# EAGLE schematic NanoAnalogic (EAGLE 5.11)
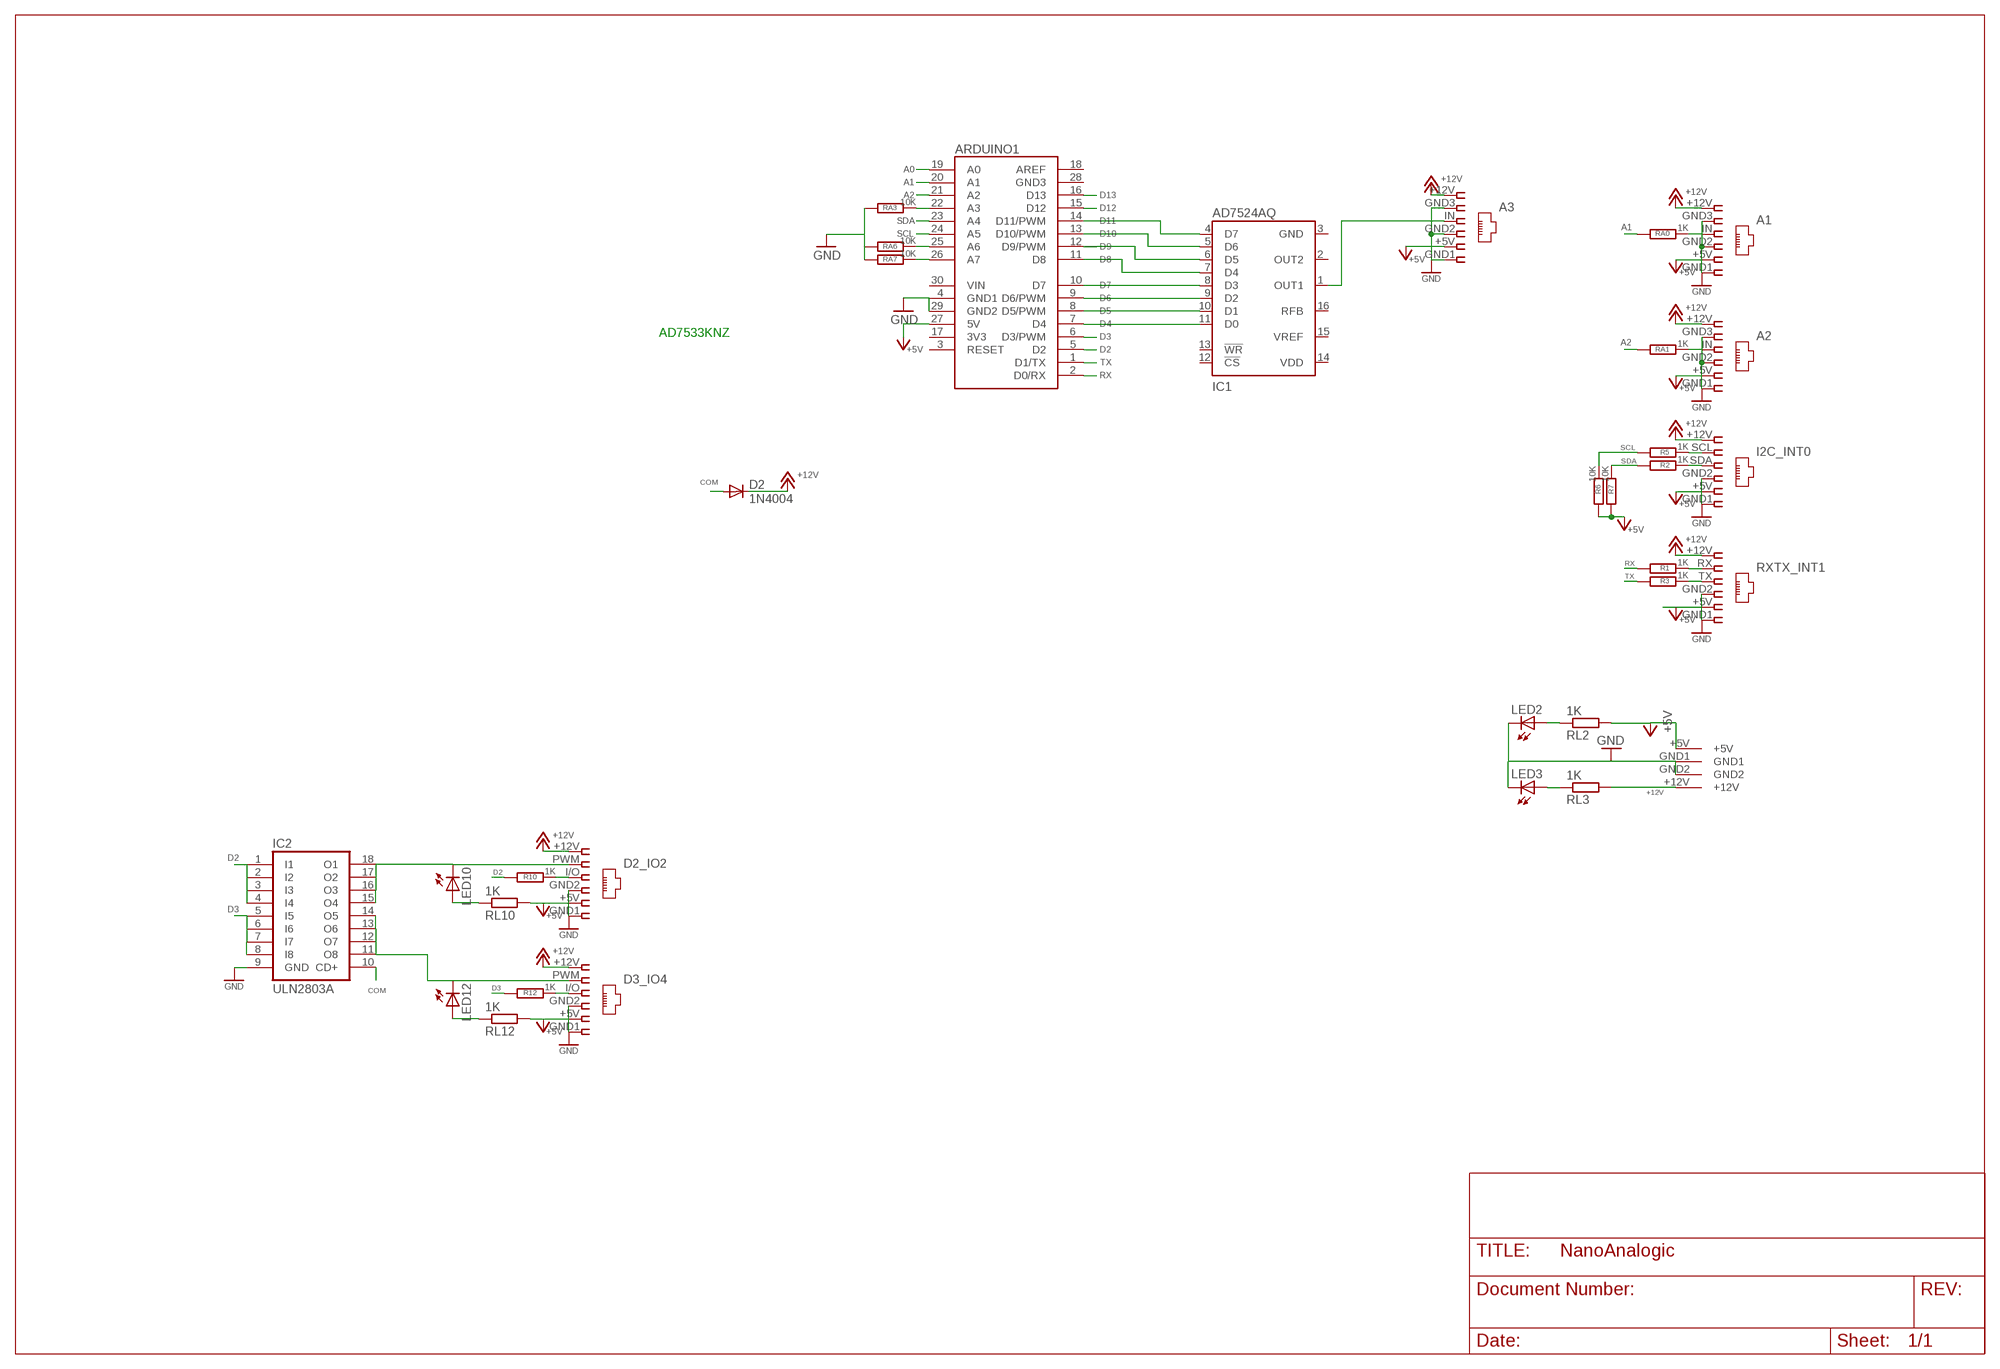
[diagram p0: schematic, sheet 1]

## Parts
A1  ANALOG1  RJ12STRAIGHT-ANALOG  [RJ12-STRAIGHT-ANALOG]
A2  ANALOG2  RJ12STRAIGHT-ANALOG  [RJ12-STRAIGHT-ANALOG]
A3  ANALOG1  RJ12STRAIGHT-ANALOG  [RJ12-STRAIGHT-ANALOG]
ARDUINO1  ARDUINO_NANO  [ARDUINO_NANO]
D2  1N4004  [DO41-10]
D2_IO2  IO2  RJ12STRAIGHT  [RJ12-STRAIGHT]
D3_IO4  IO4  RJ12STRAIGHT  [RJ12-STRAIGHT]
I2C_INT0  I2C  RJ12STRAIGHT-I2C  [RJ12-STRAIGHT-I2C]
IC1  AD7524AQ  [DIL16]
IC2  ULN2803A  [SO18W]
LED2  LED3MM  [LED3MM]
LED3  LED3MM  [LED3MM]
LED10  LED3MM  [LED3MM]
LED12  LED3MM  [LED3MM]
R1  1K  R-EU_M1206  [M1206]
R2  1K  R-EU_M1206  [M1206]
R3  1K  R-EU_M1206  [M1206]
R5  1K  R-EU_M1206  [M1206]
R6  10K  R-EU_M1206  [M1206]
R7  10K  R-EU_M1206  [M1206]
R10  1K  R-EU_M1206  [M1206]
R12  1K  R-EU_M1206  [M1206]
RA0  1K  R-EU_M1206  [M1206]
RA1  1K  R-EU_M1206  [M1206]
RA3  10K  R-EU_M1206  [M1206]
RA6  10K  R-EU_M1206  [M1206]
RA7  10K  R-EU_M1206  [M1206]
RL2  1K  R-EU_M1206  [M1206]
RL3  1K  R-EU_M1206  [M1206]
RL10  1K  R-EU_M1206  [M1206]
RL12  1K  R-EU_M1206  [M1206]
RXTX_INT1  RS232  RJ12STRAIGHT-RS232-SERVER  [RJ12-STRAIGHT-RS232]
U$1  KPJX-4S-S  [KPJX-4S-S]

## Nets
+5V [highpower]: A1.+5V A2.+5V A3.+5V ARDUINO1.27(5V) D2_IO2.+5V D3_IO4.+5V I2C_INT0.+5V R6.2 R7.2 RL2.2 RL10.2 RL12.2 RXTX_INT1.+5V U$1.+5V
+12V [highpower]: A1.+12V A2.+12V A3.+12V D2.C D2_IO2.+12V D3_IO4.+12V I2C_INT0.+12V RL3.2 RXTX_INT1.+12V U$1.+12V
A0: ARDUINO1.19(A0)
A1: ARDUINO1.20(A1) RA0.2
A2: ARDUINO1.21(A2) RA1.2
COM: D2.A IC2.10(CD+)
D2: ARDUINO1.5(D2) IC2.1(I1) IC2.2(I2) IC2.3(I3) IC2.4(I4) R10.2
D2B2: D2_IO2.I/O R10.1
D2B3: D3_IO4.I/O R12.1
D2B4: I2C_INT0.SDA R2.1
D2B5: R3.1 RXTX_INT1.TX
D2B8: A1.IN RA0.1
D2B9: A2.IN RA1.1
D3: ARDUINO1.6(D3/PWM) IC2.5(I5) IC2.6(I6) IC2.7(I7) IC2.8(I8) R12.2
D4: ARDUINO1.7(D4) IC1.11(D0)
D5: ARDUINO1.8(D5/PWM) IC1.10(D1)
D6: ARDUINO1.9(D6/PWM) IC1.9(D2)
D7: ARDUINO1.10(D7) IC1.8(D3)
D8: ARDUINO1.11(D8) IC1.7(D4)
D9: ARDUINO1.12(D9/PWM) IC1.6(D5)
D10: ARDUINO1.13(D10/PWM) IC1.5(D6)
D11: ARDUINO1.14(D11/PWM) IC1.4(D7)
D12: ARDUINO1.15(D12)
D13: ARDUINO1.16(D13)
GND [highpower]: A1.GND1 A1.GND2 A1.GND3 A2.GND1 A2.GND2 A2.GND3 A3.GND1 A3.GND2 A3.GND3 ARDUINO1.4(GND1) ARDUINO1.29(GND2) D2_IO2.GND1 D2_IO2.GND2 D3_IO4.GND1 D3_IO4.GND2 I2C_INT0.GND1 I2C_INT0.GND2 IC2.9(GND) LED2.K(C) LED3.K(C) RA3.2 RA6.2 RA7.2 RXTX_INT1.GND1 RXTX_INT1.GND2 U$1.GND1 U$1.GND2
N$1 [power]: D3_IO4.PWM IC2.11(O8) IC2.12(O7) IC2.13(O6) IC2.14(O5) LED12.K(C)
N$5: A3.IN IC1.1(OUT1)
N$7: R1.1 RXTX_INT1.RX
N$8: I2C_INT0.SCL R5.1
N$13: LED3.A RL3.1
N$16: ARDUINO1.22(A3) RA3.1
N$20: ARDUINO1.25(A6) RA6.1
N$21: LED10.A RL10.1
N$22: ARDUINO1.26(A7) RA7.1
N$23: LED2.A RL2.1
N$24 [power]: D2_IO2.PWM IC2.15(O4) IC2.16(O3) IC2.17(O2) IC2.18(O1) LED10.K(C)
N$28: LED12.A RL12.1
RX: ARDUINO1.2(D0/RX) R1.2
SCL: ARDUINO1.24(A5) R5.2 R6.1
SDA: ARDUINO1.23(A4) R2.2 R7.1
TX: ARDUINO1.1(D1/TX) R3.2
Unconnected: ARDUINO1.3(RESET) ARDUINO1.18(AREF) ARDUINO1.28(GND3) ARDUINO1.30(VIN) IC1.2(OUT2) IC1.12(!CS) IC1.13(!WR) IC1.15(VREF) IC1.16(RFB)

## Notes on the sheet
- AD7533KNZ

## Power pins joined to a net without a drawn wire
3V3: ARDUINO1.17(3V3)
GND: IC1.3(GND)
VDD: IC1.14(VDD)

## Library data of the parts
A1-A3 D2_IO2 D3_IO4 I2C_INT0 RXTX_INT1 = lpatiny:RJ12: CORCOM Modular RJ Jacks No Shield Source: www.tycoelectronics.com .. ENG_DS_1654001_1099_RJ_L_0507.pdf
ARDUINO1 = arduino:ARDUINO_NANO: Arduino Nano I/O pin arrangement
D2 = diode:1N4004: DIODE general purpose rectifier, 1 A
IC1 = analog-devices:AD7524*: 8-Bit Buffered Multiplying DAC Source: http://www.analog.com/UploadedFiles/Data_Sheets/888358036ad7524.pdf; MF: ALTERA CORPORATION; MPN: AD7524AQ; OC_FARNELL: 1464568; OC_NEWARK: 05F7379
IC2 = lpatiny:ULN2803A: DRIVER ARRAY
LED2 LED3 LED10 LED12 = lpatiny:LED3MM
R1-R3 R5-R7 R10 R12 RA0 RA1 RA3 RA6 RA7 RL2 RL3 RL10 RL12 = resistor:R-EU_: RESISTOR, European symbol
U$1 = lpatiny:KPJX-4S-S

## Net classes
0 default: width 0.457 mm
1 power: width 0.914 mm
2 highpower: width 1.372 mm